# Altium schematic sheet PowerSupply.SchDoc
size A4
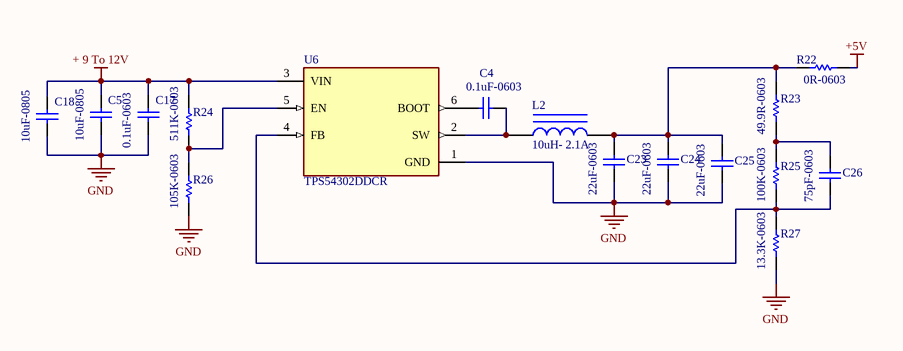
[diagram p0: PowerSupply.SchDoc]

## Parts
C4  0.1uF-0603  [C0603]
C5  10uF-0805  [C0805]
C17  0.1uF-0603  [C0603]
C18  10uF-0805  [C0805]
C23  22uF-0603  [C0603]
C24  22uF-0603  [C0603]
C25  22uF-0603  [C0603]
C26  75pF-0603  [C0603]
L2  10uH- 2.1A  [FERRITE_COIL_XFL4020_0]
R22  0R-0603  [R0603]
R23  49.9R-0603  [R0603]
R24  511K-0603  [R0603]
R25  100K-0603  [R0603]
R26  105K-0603  [R0603]
R27  13.3K-0603  [R0603]
U6  TPS54302DDCR  [SOT95P280X110-6N]

## Nets
+5V: R22.2
+ 9 To 12V: C5.2 C17.2 C18.2 R24.2 U6.3(VIN)
GND: C5.1 C17.1 C18.1 C23.2 C24.2 C25.2 R26.1 R27.1 U6.1(GND)
NetC4_1: C4.1 L2.1 U6.2(SW)
NetC4_2: C4.2 U6.6(BOOT)
NetC23_1: C23.1 C24.1 C25.1 L2.2 R22.1 R23.2
NetC26_1: C26.1 R23.1 R25.2
NetC26_2: C26.2 R25.1 R27.2 U6.4(FB)
NetR24_1: R24.1 R26.2 U6.5(EN)

## Library data of the parts
C4 = Capacitor_Ceramic: CAP CER 0.47UF 50V X7R 0603; Manufacturer Part Number: CC0603KRX7R9BB104; Manufacturer_Name: YAGEO; Value: 0.1uF-0603; Case/Package: 0603; Mount: YES
C5 C18 = Capacitor_Ceramic: CAP CER 0.47UF 50V X7R 0603; Manufacturer Part Number: CL21A106KAYNNNE; Manufacturer_Name: Samsung Electro-Mechanics; Value: 10uF-0805; Case/Package: 0805; Mount: YES
C17 = Capacitor_Ceramic: CAP CER 0.1UF 50V X7R 0603; Manufacturer Part Number: CC0603KRX7R9BB104; Manufacturer_Name: YAGEO; Value: 0.1uF-0603; Case/Package: 0603; Mount: YES
C23-C25 = Capacitor_Ceramic: CAP CER 22UF 10V X7R 0603; Manufacturer Part Number: CL10A226MP8NUNE; Manufacturer_Name: Samsung Electro-Mechanics; Value: 22uF-0603; Case/Package: 0603; Mount: YES
C26 = Capacitor_Ceramic: CAP CER 22UF 10V X7R 0603; Manufacturer Part Number: CC0603JRNPO9BN750; Manufacturer_Name: YAGEO; Value: 75pF-0603; Case/Package: 0603; Mount: YES
L2 = Ferrite_Coil: Power Inductors 2.1A 10uH ±20% 30mΩ SMD,4x4x3mm; Manufacturer Part Number: SWPA4030S100MT; Case/Package: 4x4x3; Mount: Yes; Value: 10uH- 2.1A
R22 = RES_3.3k_0603: RES 0 OHM 1% 1/8W 0603; Manufacturer Part Number: RMCF0603ZT0R00; Manufacturer_Name: Stackpole Electronics Inc; Value: 0R-0603; Case/Package: 0603; Mount: YES
R23 = RES_3.3k_0603: RES 49.9 OHM 1% 1/10W 0603; Manufacturer Part Number: RC0603FR-0749R9L; Manufacturer_Name: YAGEO; Value: 49.9R-0603; Case/Package: 0603; Mount: YES
R24 = RES_3.3k_0603: RES 511K OHM 1% 1/10W 0603; Manufacturer Part Number: AC0603FR-07511KL; Manufacturer_Name: YAGEO; Value: 511K-0603; Case/Package: 0603; Mount: YES
R25 = RES_3.3k_0603: RES 100K OHM 1% 1/10W 0603; Manufacturer Part Number: RC0603JR-07100KL; Manufacturer_Name: YAGEO; Value: 100K-0603; Case/Package: 0603; Mount: YES
R26 = RES_3.3k_0603: RES 105K OHM 1% 1/10W 0603; Manufacturer Part Number: RC0603FR-07105KL; Manufacturer_Name: Stackpole Electronics Inc; Value: 105K-0603; Case/Package: 0603; Mount: YES
R27 = RES_3.3k_0603: RES 13.3K OHM 1% 1/10W 0603; Manufacturer Part Number: RC0603FR-0713K3L; Manufacturer_Name: YAGEO; Value: 13.3K-0603; Case/Package: 0603; Mount: YES
U6 = TPS54X02DDCR: 4.5-V to 28-V Input, 2/3-A Output, EMI Friendly Synchronous Step-Down Converter 6-SOT-23-THIN -40 to 125; Value: *; Case/Package: SOT-23-THIN (6); Manufacturer Part Number: TPS54302DDCR